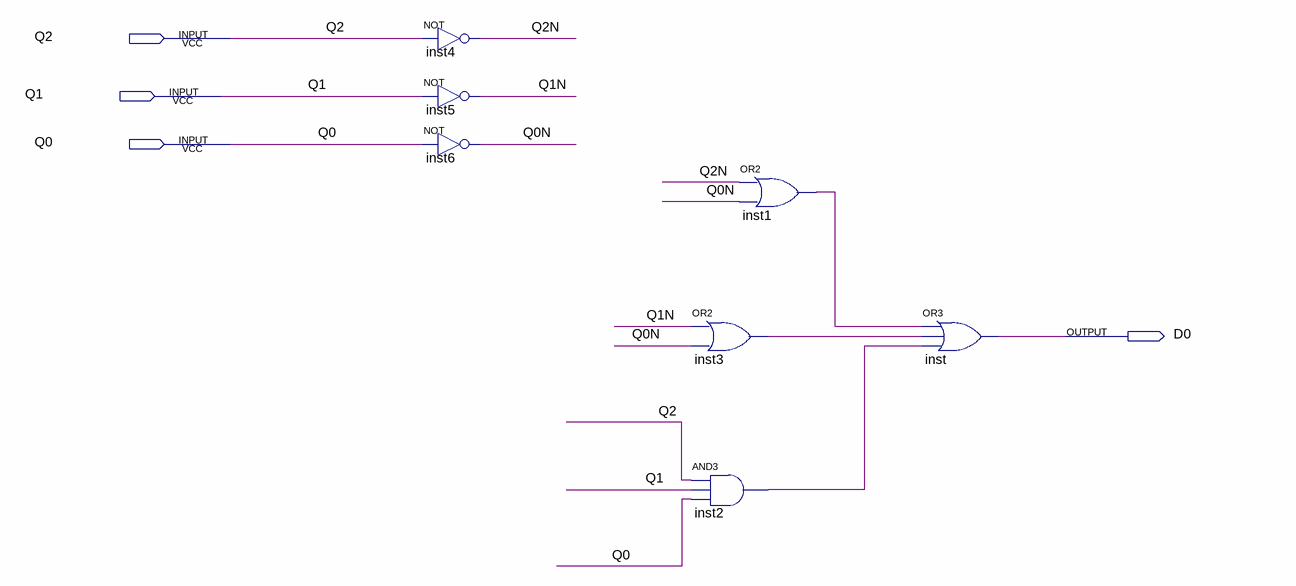
[diagram p0: schematic sheet]
// Quartus schematic D0.bdf as structural Verilog: 7 symbols, 4 pins
module D0 (
  input  Q2,
  input  Q1,
  input  Q0,
  output D0
);

  wire inst1_out, inst2_out, inst3_out, Q0N, Q1N, Q2N;

  not inst4 (Q2N, Q2);
  not inst5 (Q1N, Q1);
  not inst6 (Q0N, Q0);
  or inst3 (inst3_out, Q1N, Q0N);
  and inst2 (inst2_out, Q2, Q1, Q0);
  or inst1 (inst1_out, Q2N, Q0N);
  or inst (D0, inst1_out, inst3_out, inst2_out);
endmodule
